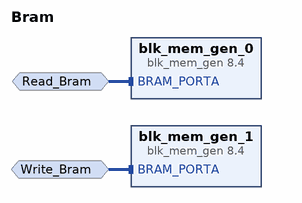
[diagram p0: block diagram of the top level]
# Vivado block design Bram, xc7a100tcsg324-1, Vivado 2022.1
create_bd_design Bram

create_bd_intf_port -mode Slave -vlnv xilinx.com:interface:bram_rtl:1.0 Read_Bram
set_property -dict {CONFIG.READ_WRITE_MODE READ_ONLY} [get_bd_intf_ports Read_Bram]
create_bd_intf_port -mode Slave -vlnv xilinx.com:interface:bram_rtl:1.0 Write_Bram
set_property -dict {CONFIG.READ_WRITE_MODE WRITE_ONLY} [get_bd_intf_ports Write_Bram]

create_bd_cell -type ip -vlnv xilinx.com:ip:blk_mem_gen:8.4 blk_mem_gen_0
set_property -dict [list \
  CONFIG.Coe_File ../../../../../../../Desktop/awsomeitem.coe \
  CONFIG.Enable_32bit_Address false \
  CONFIG.Fill_Remaining_Memory_Locations true \
  CONFIG.Load_Init_File true \
  CONFIG.Read_Width_A 8 \
  CONFIG.Register_PortA_Output_of_Memory_Primitives true \
  CONFIG.Use_Byte_Write_Enable false \
  CONFIG.Use_RSTA_Pin false \
  CONFIG.Write_Depth_A 95400 \
  CONFIG.Write_Width_A 8 \
  CONFIG.use_bram_block Stand_Alone \
] [get_bd_cells blk_mem_gen_0]
create_bd_cell -type ip -vlnv xilinx.com:ip:blk_mem_gen:8.4 blk_mem_gen_1
set_property -dict [list \
  CONFIG.Enable_32bit_Address false \
  CONFIG.Fill_Remaining_Memory_Locations true \
  CONFIG.Read_Width_A 8 \
  CONFIG.Register_PortA_Output_of_Memory_Primitives true \
  CONFIG.Use_Byte_Write_Enable false \
  CONFIG.Use_RSTA_Pin false \
  CONFIG.Write_Depth_A 95400 \
  CONFIG.Write_Width_A 8 \
  CONFIG.use_bram_block Stand_Alone \
] [get_bd_cells blk_mem_gen_1]

# ---- connections ----

connect_bd_intf_net -intf_net BRAM_PORTA_0_1 [get_bd_intf_ports Read_Bram] [get_bd_intf_pins blk_mem_gen_0/BRAM_PORTA]
connect_bd_intf_net -intf_net BRAM_PORTA_1_1 [get_bd_intf_ports Write_Bram] [get_bd_intf_pins blk_mem_gen_1/BRAM_PORTA]

validate_bd_design
save_bd_design
